# Altium schematic sheet power.SchDoc
size A4; DocumentNumber: 2; SheetNumber: 2; SheetTotal: 5
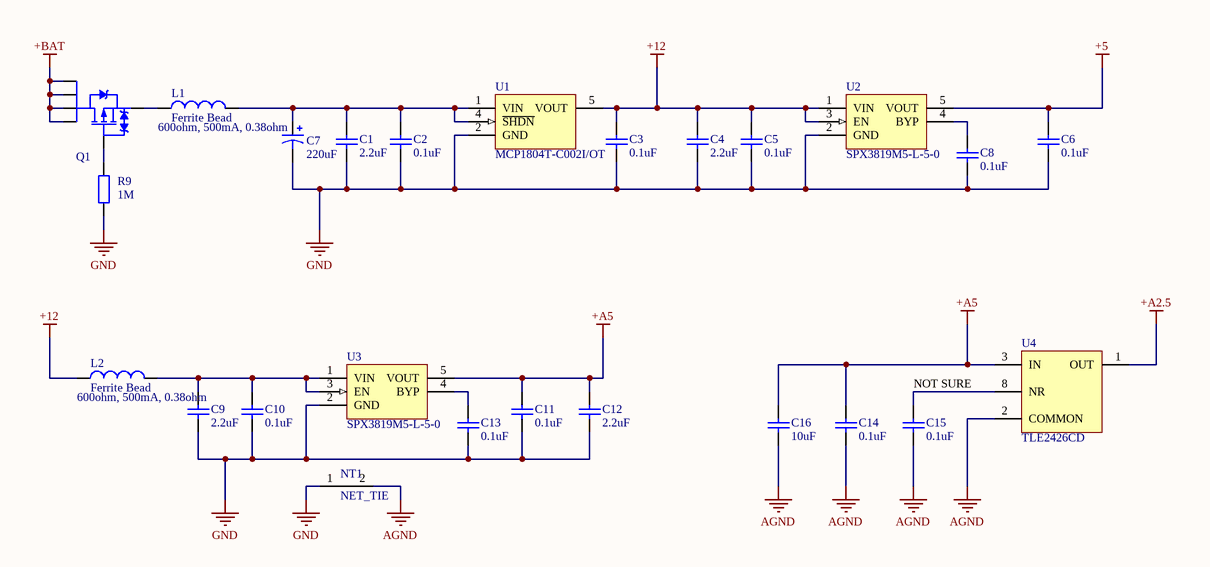
[diagram p0: power.SchDoc]

## Parts
C1  value 2.2uF  [C0805]  (hidden comment: Cap)
C2  value 0.1uF  [C0805]  (hidden comment: Cap)
C3  value 0.1uF  [C0805]  (hidden comment: Cap)
C4  value 2.2uF  [C0805]  (hidden comment: Cap)
C5  value 0.1uF  [C0805]  (hidden comment: Cap)
C6  value 0.1uF  [C0805]  (hidden comment: Cap)
C7  value 220uF  [EEUFM1V221L]  (hidden comment: Cap Pol1)
C8  value 0.1uF  [C0805]  (hidden comment: Cap)
C9  value 2.2uF  [C0805]  (hidden comment: Cap)
C10  value 0.1uF  [C0805]  (hidden comment: Cap)
C11  value 0.1uF  [C0805]  (hidden comment: Cap)
C12  value 2.2uF  [C0805]  (hidden comment: Cap)
C13  value 0.1uF  [C0805]  (hidden comment: Cap)
C14  value 0.1uF  [C0805]  (hidden comment: Cap)
C15  value 0.1uF  [C0805]  (hidden comment: Cap)
C16  value 10uF  [C0805]  (hidden comment: Cap)
L1  Ferrite Bead  value 600ohm, 500mA, 0.38ohm  [BLM18AG221SN1D]
L2  Ferrite Bead  value 600ohm, 500mA, 0.38ohm  [BLM18AG221SN1D]
NT1  NET_TIE  [NETTIE]  (net tie)
Q1  PMOSFET_P  [FDC608PZ]  (value not drawn)
R9  value 1M  [R0603]  (hidden comment: Res2)
U1  MCP1804T-C002I/OT  [MCP1804T-C002I/OT]
U2  SPX3819M5-L-5-0  [SPX3819M5-L-5-0]
U3  SPX3819M5-L-5-0  [SPX3819M5-L-5-0]
U4  TLE2426CD  [TLE2426CD]

## Nets
+5: C6.2 U2.5(VOUT)
+12: C3.2 C4.2 C5.2 L2.1 U1.5(VOUT) U2.1(VIN) U2.3(EN)
+A2.5: U4.1(OUT)
+A5: C11.2 C12.2 C14.2 C16.2 U3.5(VOUT) U4.3(IN)
+BAT: Q1.1(D) Q1.2(D) Q1.5(D) Q1.6(D)
AGND: C14.1 C15.1 C16.1 NT1.2 U4.2(COMMON)
GND: C1.1 C2.1 C3.1 C4.1 C5.1 C6.1 C7.2 C8.1 C9.1 C10.1 C11.1 C12.1 C13.1 NT1.1 R9.1 U1.2(GND) U2.2(GND) U3.2(GND)
NetC1_2: C1.2 C2.2 C7.1 L1.2 U1.1(VIN) U1.4(~{SHDN})
NetC8_2: C8.2 U2.4(BYP)
NetC9_2: C9.2 C10.2 L2.2 U3.1(VIN) U3.3(EN)
NetC13_2: C13.2 U3.4(BYP)
NetC15_2: C15.2 U4.8(NR)
NetL1_1: L1.1 Q1.4(S)
NetQ1_3: Q1.3(G) R9.2

## Notes on the sheet
- (near C15) NOT SURE

## Library data of the parts
C1-C6 C8-C16 = Cap: Capacitor; Published: 8-Jun-2000; LatestRevisionDate: 17-Jul-2002; LatestRevisionNote: Re-released for DXP Platform.; PackageReference: RAD-0.3; Publisher: Altium Limited
  C1 C4 C9 C12: farnell: 1845749
  C2 C3 C5 C6 C8 C10 C11 C13-C15: farnell: 1414664
  C16: farnell: 1463362
C7 = Cap Pol1: Polarized Capacitor (Radial); pin to pad: 1>2 2>1; Published: 8-Jun-2000; LatestRevisionDate: 17-Jul-2002; LatestRevisionNote: Re-released for DXP Platform.; PackageReference: RB7.6-15; Publisher: Altium Limited; farnell: 1219473
L1 L2 = Inductor: Code_IEC: 1005; Published: 8-Jun-2000; LatestRevisionDate: 29-May-2009; LatestRevisionNote: IPC-7351 Footprint Added.; PackageReference: 0402-A; Publisher: Altium Limited; PackageDescription: Chip Inductor; Code_JEITA: 0402; farnell: 1515679
Q1 = PMOSFET_P: FAIRCHILD SEMICONDUCTOR - FDC608PZ - MOSFET, P, SMD, SSOT-6; farnell: 1495225
R9 = Res2: Resistor; Published: 8-Jun-2000; LatestRevisionDate: 17-Jul-2002; LatestRevisionNote: Re-released for DXP Platform.; PackageReference: AXIAL-0.4; Publisher: Altium Limited; farnell: 9330410; farnell: 9331298
U1 = MCP1804T-C002I/OT: MICROCHIP - MCP1804T-C002I/OT - IC, LDO, 12V, 150MA, 5SOT23; farnell: 1825011
U2 U3 = SPX3819M5-L-5-0: EXAR - SPX3819M5-L-5-0 - LDO, 500MA, 5V, LOW NOISE, 5SOT23; farnell: 1831950
U4 = TLE2426CD: TEXAS INSTRUMENTS - TLE2426CD - VIRTUAL GROUND REFERENCE, SMD, 2426; farnell: 8454809